# Altium schematic sheet TachometerModule.SchDoc: Tachometer Module
size A; SheetNumber: 8; SheetTotal: 9
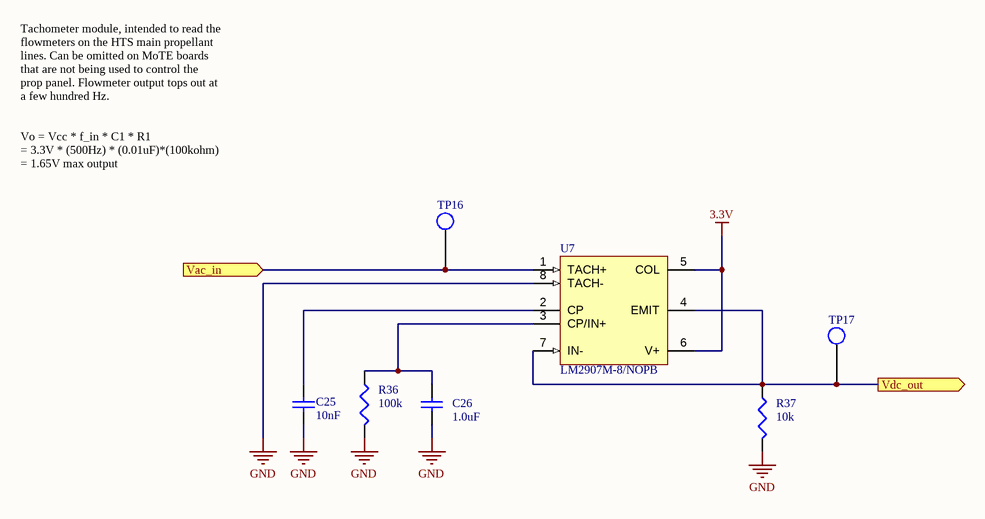
[diagram p0: TachometerModule.SchDoc]

## Parts
C25  value 10nF  [1608[0603]]  (hidden comment: Cap)
C26  value 1.0uF  [1608[0603]]  (hidden comment: a)
R36  value 100k  [J1-0603]  (hidden comment: Res3)
R37  value 10k  [J1-0603]  (hidden comment: Res3)
TP16  BURPG_TestPoint1  [BURPG_TestPoint1]  (value not drawn)  (no BOM)
TP17  BURPG_TestPoint1  [BURPG_TestPoint1]  (value not drawn)  (no BOM)
U7  LM2907M-8/NOPB  [D0008A_L]

## Ports
Vac_in (in), Vdc_out (out)

## Nets
3.3V: U7.5(COL) U7.6(V+)
GND: C25.2 C26.1 R36.2 R37.2 U7.8(TACH-)
Vac_in: TP16.1 U7.1(TACH+) ; port Vac_in
Vdc_out: R37.1 TP17.1 U7.4(EMIT) U7.7(IN-) ; port Vdc_out
NetC25_1: C25.1 U7.2(CP)
NetC26_2: C26.2 R36.1 U7.3(CP/IN+)

## Notes on the sheet
- Tachometer module, intended to read the flowmeters on the HTS main propellant lines. Can be omitted on MoTE boards that are not being used to control the prop panel. Flowmeter output tops out at a few hundred Hz.
  Vo = Vcc * f_in * C1 * R1
  = 3.3V * (500Hz) * (0.01uF)*(100kohm) = 1.65V max output
- PROJECT
- Drawn:
- Approved:
- APPROVALS
- DATE
- SCALE:
- SIZE
- A
- Title
- FILE NAME
- SHEET
- OF
- REV

## Library data of the parts
C25 = Cap: Capacitor; Published: 8-Jun-2000; LatestRevisionDate: 17-Jul-2002; LatestRevisionNote: Re-released for DXP Platform.; PackageReference: RAD-0.3; Publisher: Altium Limited; PackageDescription: Radial Cap, Thru-Hole; 2 Leads; 0.3 in Pin Spacing
C26 = Cap: low ESR film cap; Published: 8-Jun-2000; LatestRevisionDate: 17-Jul-2002; LatestRevisionNote: Re-released for DXP Platform.; PackageReference: RAD-0.3; Publisher: Altium Limited; PackageDescription: Radial Cap, Thru-Hole; 2 Leads; 0.3 in Pin Spacing
R36 R37 = Res3: Resistor; Published: 8-Jun-2000; LatestRevisionDate: 29-May-2009; LatestRevisionNote: IPC-7351 Footprint Added.; PackageReference: J1-0603; Publisher: Altium Limited; PackageDescription: Chip Resistor
U7 = CMP-0063-00664-3: Frequency to Voltage Converter, 8-pin Narrow SOIC, Pb-Free; Manufacturer: Texas Instruments; PackageTopMarking: NSZXTT*LM29*07M-8; CompType: MiscPower; PowerWise: N; ComponentLink1URL: http://www.ti.com/general/docs/lit/getliterature.tsp?genericPartNumber=LM2907-N&fileType=pdf; Code_IPC: SOIC127P600-8; RoHS: Y; PackageReference: D0008A; Code_JEDEC: MS-012-AA; PinCount: 8; PackageDescription: SOIC Narrow, 4.9 x 3.9 x 1.45mm, 8 Lead, 1.27mm Pitch; ComponentLink1Description: Datasheet URL